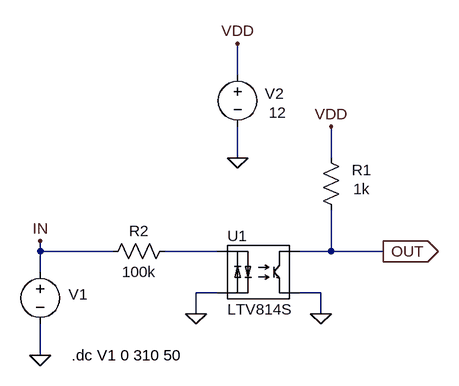
[diagram p0: schematic Opto_LTV814.asc]
Opto_LTV814.asc, the LTspice schematic file:
Version 4.1
SHEET 1 1116 680
WIRE 224 -144 224 -192
WIRE 224 -16 224 -64
WIRE 368 -16 368 -64
WIRE -80 128 -80 112
WIRE 32 128 -80 128
WIRE 192 128 112 128
WIRE 368 128 368 64
WIRE 368 128 320 128
WIRE 448 128 368 128
WIRE -80 160 -80 128
WIRE 192 192 160 192
WIRE 352 192 320 192
WIRE 160 224 160 192
WIRE 352 224 352 192
WIRE -80 288 -80 240
FLAG 160 224 0
FLAG -80 288 0
FLAG 224 -16 0
FLAG -80 112 IN
FLAG 224 -192 VDD
FLAG 368 -64 VDD
FLAG 352 224 0
FLAG 448 128 OUT
IOPIN 448 128 Out
SYMBOL res 352 -32 R0
WINDOW 0 48 35 Left 2
WINDOW 3 50 64 Left 2
SYMATTR InstName R1
SYMATTR Value 1k
SYMBOL voltage -80 144 R0
WINDOW 123 0 0 Left 0
WINDOW 39 0 0 Left 0
WINDOW 0 44 50 Left 2
WINDOW 3 24 96 Left 0
SYMATTR InstName V1
SYMATTR Value ""
SYMBOL res 128 112 R90
WINDOW 0 0 56 VBottom 2
WINDOW 3 32 56 VTop 2
SYMATTR InstName R2
SYMATTR Value 100k
SYMBOL voltage 224 -160 R0
WINDOW 123 0 0 Left 0
WINDOW 39 0 0 Left 0
WINDOW 0 42 45 Left 2
WINDOW 3 48 74 Left 2
SYMATTR InstName V2
SYMATTR Value 12
SYMBOL MyLib\\Opto\\LTV814 256 160 R0
SYMATTR InstName U1
TEXT -32 288 Left 2 !.dc V1 0 310 50

The netlist it stands for:
* Opto_LTV814.asc
R1 VDD OUT 1k
V1 IN 0
R2 N001 IN 100k
V2 VDD 0 12
X§U1 N001 0 OUT 0 LTV814S  ; pins A K C E
.dc V1 0 310 50
.lib MyLib/Opto/LTV814.lib
.backanno
.end

* Results of the author's LTspice run, read from the files saved beside the schematic
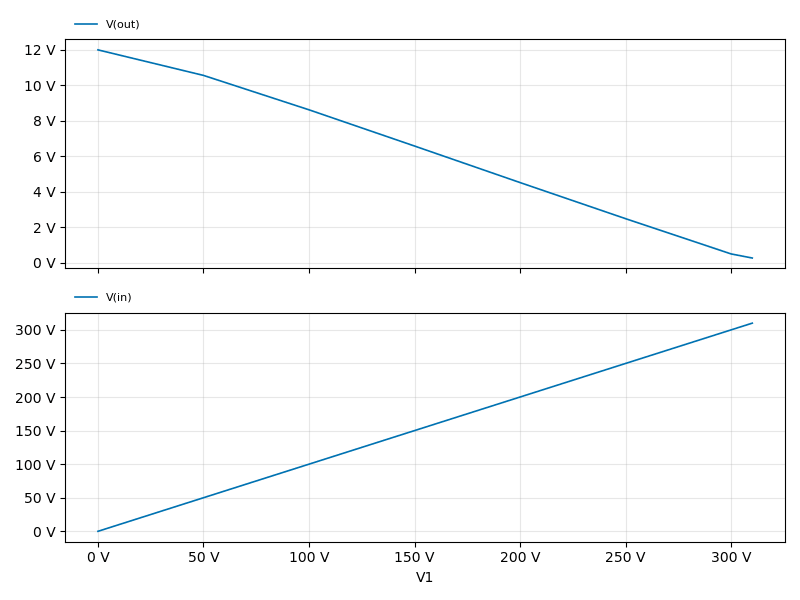
[diagram p1: DC transfer characteristic of Opto_LTV814.asc, plotted from the saved traces]
* DC transfer characteristic, 1 run:
*   V(out): 12 V at V1=0 V, 254 mV at V1=310 V, min 254 mV, max 12 V
*   V(in): 0 V at V1=0 V, 310 V at V1=310 V, min 0 V, max 310 V